# Altium project base_tiempo.PrjPcb
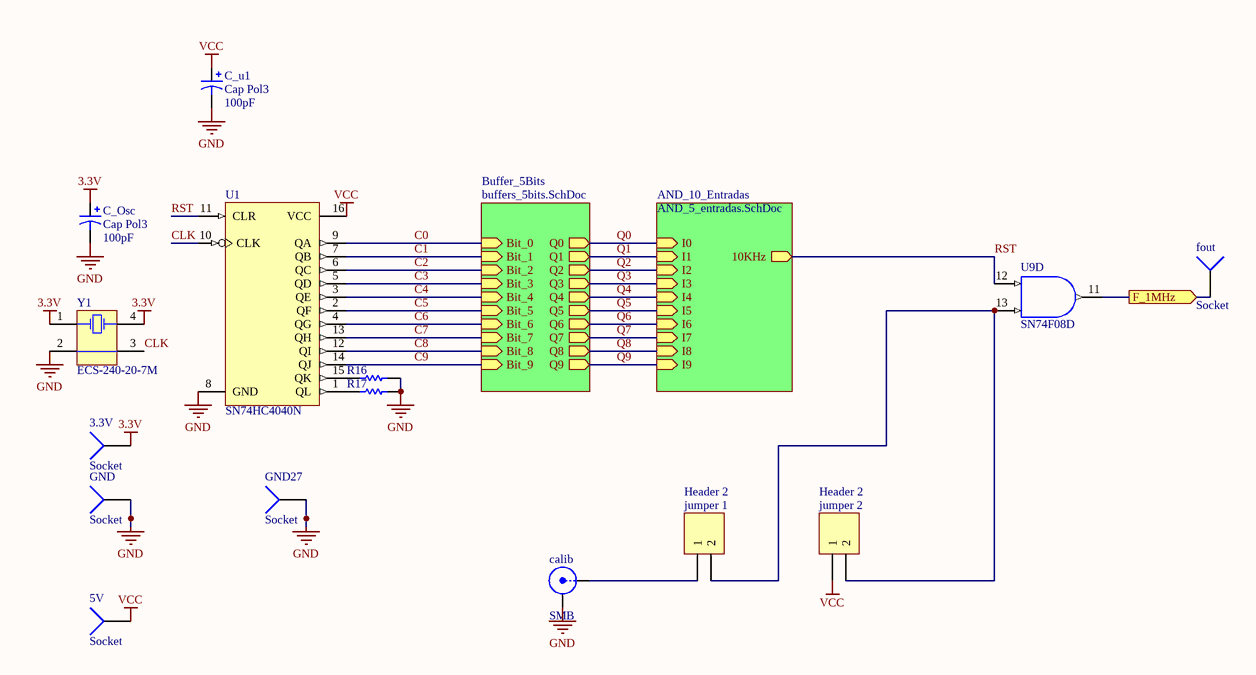
[diagram p0: base_tiempo.SchDoc]
3 sheets, 28 parts. Net scope: hierarchical (ports join the sheet entries above them; power ports are global).
Board file: base_tiempo.PcbDoc
Sheets:
  base_tiempo.SchDoc
    Buffer_5Bits = buffers_5bits.SchDoc
    AND_10_Entradas = AND_5_entradas.SchDoc

## Sheet base_tiempo.SchDoc: Base de tiempo
size A4; Revision: 1

### Parts
3.3V  Socket  [PIN1]
5V  Socket  [PIN1]
C_Osc  Cap Pol3  value 100pF  [C0805]
C_u1  Cap Pol3  value 100pF  [C0805]
calib  SMB  [SMB_V-RJ45]
fout  Socket  [PIN1]
GND  Socket  [PIN1]
GND27  Socket  [PIN1]
jumper_1  Header 2  [HDR1X2]
jumper_2  Header 2  [HDR1X2]
R16  Res Semi  [2012[0805]]  (value not drawn)
R17  Res Semi  [2012[0805]]  (value not drawn)
U1  SN74HC4040N  [N016]
U9  SN74F08D  [D014_N]  (part D of 4)
Y1  ECS-240-20-7M  [ECX-3M]

### Sub-sheets
AND_10_Entradas = AND_5_entradas.SchDoc: I0 (in), I1 (in), I2 (in), I3 (in), I4 (in), 10KHz (out), I5 (in), I6 (in), I7 (in), I8 (in), I9 (in)
Buffer_5Bits = buffers_5bits.SchDoc: Bit_0 (in), Bit_1 (in), Bit_2 (in), Bit_3 (in), Bit_4 (in), Q0 (out), Q1 (out), Q2 (out), Q3 (out), Q4 (out), Bit_5 (in), Bit_6 (in), Bit_7 (in), Bit_8 (in), Bit_9 (in), Q5 (out), Q6 (out), Q7 (out), Q8 (out), Q9 (out)

### Ports
F_1MHz (out)

### Nets
3.3V: 3.3V.1 C_Osc.1 Y1.1(OSC1) Y1.4(OSC2)
GND: C_Osc.2 C_u1.2 calib.2(Y) GND.1 GND27.1 R16.2 R17.2 U1.8(GND) U9.7(GND) Y1.2(COM)
VCC: 5V.1 C_u1.1 jumper_2.1 U1.16(VCC) U9.14(VCC)
C0: U1.9(QA) ; sheet Buffer_5Bits/Bit_0
C1: U1.7(QB) ; sheet Buffer_5Bits/Bit_1
C2: U1.6(QC) ; sheet Buffer_5Bits/Bit_2
C3: U1.5(QD) ; sheet Buffer_5Bits/Bit_3
C4: U1.3(QE) ; sheet Buffer_5Bits/Bit_4
C5: U1.2(QF) ; sheet Buffer_5Bits/Bit_5
C6: U1.4(QG) ; sheet Buffer_5Bits/Bit_6
C7: U1.13(QH) ; sheet Buffer_5Bits/Bit_7
C8: U1.12(QI) ; sheet Buffer_5Bits/Bit_8
C9: U1.14(QJ) ; sheet Buffer_5Bits/Bit_9
CLK: U1.10(CLK) Y1.3(COM)
Q0: sheet Buffer_5Bits/Q0, sheet AND_10_Entradas/I0
Q1: sheet Buffer_5Bits/Q1, sheet AND_10_Entradas/I1
Q2: sheet Buffer_5Bits/Q2, sheet AND_10_Entradas/I2
Q3: sheet Buffer_5Bits/Q3, sheet AND_10_Entradas/I3
Q4: sheet Buffer_5Bits/Q4, sheet AND_10_Entradas/I4
Q5: sheet Buffer_5Bits/Q5, sheet AND_10_Entradas/I5
Q6: sheet Buffer_5Bits/Q6, sheet AND_10_Entradas/I6
Q7: sheet Buffer_5Bits/Q7, sheet AND_10_Entradas/I7
Q8: sheet Buffer_5Bits/Q8, sheet AND_10_Entradas/I8
Q9: sheet Buffer_5Bits/Q9, sheet AND_10_Entradas/I9
RST: U1.11(CLR) U9.12(A) ; sheet AND_10_Entradas/10KHz  [project net 10KHz]
Netcalib_1: calib.1(X) jumper_1.1
Netfout_1: fout.1 U9.11(Y) ; port F_1MHz
Netjumper_1_2: jumper_1.2 jumper_2.2 U9.13(B)
NetR16_1: R16.1 U1.15(QK)
NetR17_1: R17.1 U1.1(QL)

### Library data of the parts
C_Osc C_u1 = Cap Pol3: Polarized Capacitor (Surface Mount); Published: 8-Jun-2000; LatestRevisionDate: 17-Jul-2002; LatestRevisionNote: Re-released for DXP Platform.; PackageReference: C0805; Publisher: Altium Limited
calib = SMB: SMB Straight Connector; LatestRevisionDate: 17-Jul-2002; LatestRevisionNote: Re-released for DXP Platform.; Publisher: Altium Limited
jumper_1 jumper_2 = Header 2: Header, 2-Pin; LatestRevisionDate: 17-Jul-2002; LatestRevisionNote: Re-released for DXP Platform.; Publisher: Altium Limited
R16 R17 = Res Semi: Semiconductor Resistor; Value: 1K; Published: 8-Jun-2000; LatestRevisionDate: 17-Jul-2002; LatestRevisionNote: Re-released for DXP Platform.; PackageReference: AXIAL-0.5; Publisher: Altium Limited
U1 = SN74HC4040N: 12-Bit Asynchronous Binary Counter; Published: 8-Jun-2000; LatestRevisionDate: 04-Mar-2005; LatestRevisionNote: Stylized 3D Model Added.; DatasheetVersion: May-1997; PackageVersion: Oct-1995; PackageReference: N016; Publisher: Altium Limited; PackageDescription: DIP; 16 Leads; Row Spacing 7.62 mm; Pitch 2.54 mm; Code_JEDEC: MS-001-BB; ComponentLink1Description: Manufacturer Link; ComponentLink1URL: http://www.ti.com/; ComponentLink2Description: Datasheet; ComponentLink2URL: http://www-s.ti.com/sc/ds/sn74hc4040.pdf
U9 = SN74F08D: Quadruple 2-Input Positive-AND Gate; Published: 8-Jun-2000; LatestRevisionDate: 13-Apr-2006; LatestRevisionNote: IPC-7351 Footprint Added.; DatasheetVersion: Oct-1993; PackageVersion: Jan-1998; PackageReference: D014; Publisher: Altium Limited; PackageDescription: 14-Pin Small Outline Integrated Circuit 1.27 mm Pitch; Code_IPC: SOIC127P600-14; ComponentLink1Description: Manufacturer Link; ComponentLink1URL: http://www.ti.com/; ComponentLink2Description: Datasheet; ComponentLink2URL: http://www-s.ti.com/sc/ds/SN74F08.pdf
Y1 = ECS-240-20-7M: Crystal Oscillator; Published: 17-Jul-2002; DatasheetDocument: 18-Apr-2000; PackageReference: ECX-3M; Publisher: Altium Limited; ComponentLink1Description: Manufacturer Link; ComponentLink1URL: http://www.ecsxtal.com/
3.3V 5V fout GND GND27 = Socket: LatestRevisionDate: 17-Jul-2002; LatestRevisionNote: Re-released for DXP Platform.; Publisher: Altium Limited

## Sheet buffers_5bits.SchDoc
size A4
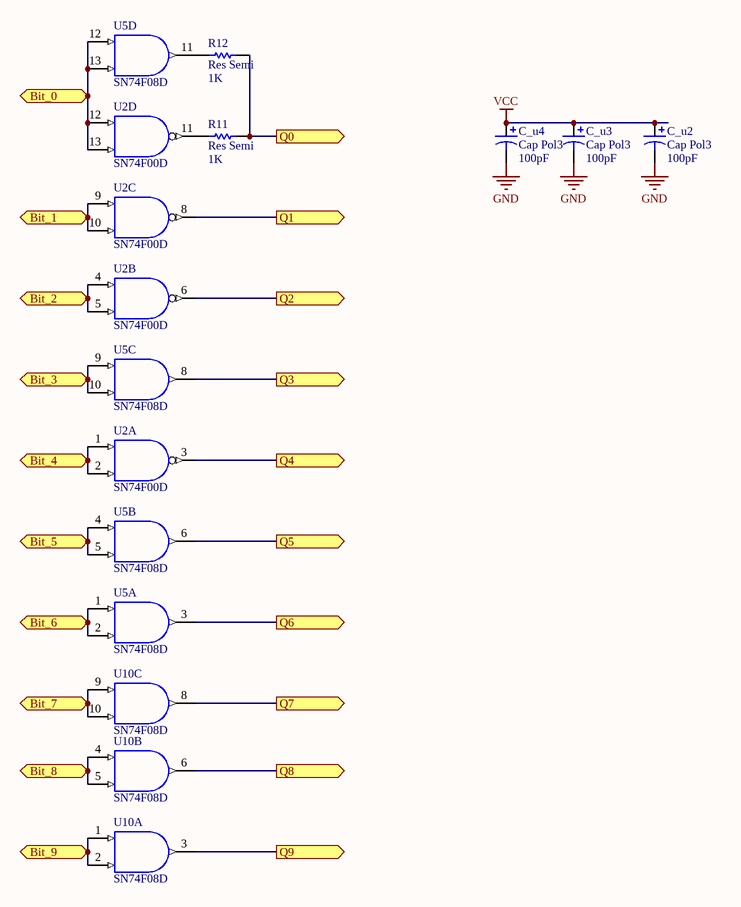
[diagram p1: buffers_5bits.SchDoc]

### Parts
C_u2  Cap Pol3  value 100pF  [C0805]
C_u3  Cap Pol3  value 100pF  [C0805]
C_u4  Cap Pol3  value 100pF  [C0805]
R11  Res Semi  value 1K  [2012[0805]]
R12  Res Semi  value 1K  [2012[0805]]
U2  SN74F00D  [D014_N]  (parts A,B,C,D of 4)
U5  SN74F08D  [D014_N]  (parts A,B,C,D of 4)
U10  SN74F08D  [D014_N]  (parts A,B,C of 4)

### Ports
Bit_0 (in), Bit_1 (in), Bit_2 (in), Bit_3 (in), Bit_4 (in), Bit_5 (in), Bit_6 (in), Bit_7 (in), Bit_8 (in), Bit_9 (in), Q0 (out), Q1 (out), Q2 (out), Q3 (out), Q4 (out), Q5 (out), Q6 (out), Q7 (out), Q8 (out), Q9 (out)

### Nets
GND: C_u2.2 C_u3.2 C_u4.2 U2.7(GND) U5.7(GND) U10.7(GND)
VCC: C_u2.1 C_u3.1 C_u4.1 U2.14(VCC) U5.14(VCC) U10.14(VCC)
C0: U2.12(A) U2.13(B) U5.12(A) U5.13(B) ; port Bit_0
C1: U2.9(A) U2.10(B) ; port Bit_1
C2: U2.4(A) U2.5(B) ; port Bit_2
C3: U5.9(A) U5.10(B) ; port Bit_3
C4: U2.1(A) U2.2(B) ; port Bit_4
C5: U5.4(A) U5.5(B) ; port Bit_5
C6: U5.1(A) U5.2(B) ; port Bit_6
C7: U10.9(A) U10.10(B) ; port Bit_7
C8: U10.4(A) U10.5(B) ; port Bit_8
C9: U10.1(A) U10.2(B) ; port Bit_9
Q0: R11.1 R12.1 ; port Q0
Q1: U2.8(Y) ; port Q1
Q2: U2.6(Y) ; port Q2
Q3: U5.8(Y) ; port Q3
Q4: U2.3(Y) ; port Q4
Q5: U5.6(Y) ; port Q5
Q6: U5.3(Y) ; port Q6
Q7: U10.8(Y) ; port Q7
Q8: U10.6(Y) ; port Q8
Q9: U10.3(Y) ; port Q9
NetR11_2: R11.2 U2.11(Y)
NetR12_2: R12.2 U5.11(Y)

### Library data of the parts
C_u2-C_u4 = Cap Pol3: Polarized Capacitor (Surface Mount); Published: 8-Jun-2000; LatestRevisionDate: 17-Jul-2002; LatestRevisionNote: Re-released for DXP Platform.; PackageReference: C0805; Publisher: Altium Limited
R11 R12 = Res Semi: Semiconductor Resistor; Published: 8-Jun-2000; LatestRevisionDate: 17-Jul-2002; LatestRevisionNote: Re-released for DXP Platform.; PackageReference: AXIAL-0.5; Publisher: Altium Limited
U2 = SN74F00D: Quadruple 2-Input Positive-NAND Gate; Published: 8-Jun-2000; LatestRevisionDate: 13-Apr-2006; LatestRevisionNote: IPC-7351 Footprint Added.; DatasheetVersion: Oct-1993; PackageVersion: Jan-1998; PackageReference: D014; Publisher: Altium Limited; PackageDescription: 14-Pin Small Outline Integrated Circuit 1.27 mm Pitch; Code_IPC: SOIC127P600-14; ComponentLink1Description: Manufacturer Link; ComponentLink1URL: http://www.ti.com/; ComponentLink2Description: Datasheet; ComponentLink2URL: http://www-s.ti.com/sc/ds/SN54F00.pdf
U5 U10 = SN74F08D: Quadruple 2-Input Positive-AND Gate; Published: 8-Jun-2000; LatestRevisionDate: 13-Apr-2006; LatestRevisionNote: IPC-7351 Footprint Added.; DatasheetVersion: Oct-1993; PackageVersion: Jan-1998; PackageReference: D014; Publisher: Altium Limited; PackageDescription: 14-Pin Small Outline Integrated Circuit 1.27 mm Pitch; Code_IPC: SOIC127P600-14; ComponentLink1Description: Manufacturer Link; ComponentLink1URL: http://www.ti.com/; ComponentLink2Description: Datasheet; ComponentLink2URL: http://www-s.ti.com/sc/ds/SN74F08.pdf

## Sheet AND_5_entradas.SchDoc
size A4; PageSetup: Record=PageOptions|CenterHorizontal=True|CenterVertical=True|PrintScale=0.97|XCorrection=1.00|YCorrection=1.00|PrintKind=2|BorderSize=5000000|LeftOffset=0|BottomOffset=0|Orientation=2|PaperLength=1000|PaperWidth=1000|Scale=100|PaperSource=7|PrintQuality=-4|MediaType=1|DitherType=10|PaperKind=A4|PrintScaleMode=1
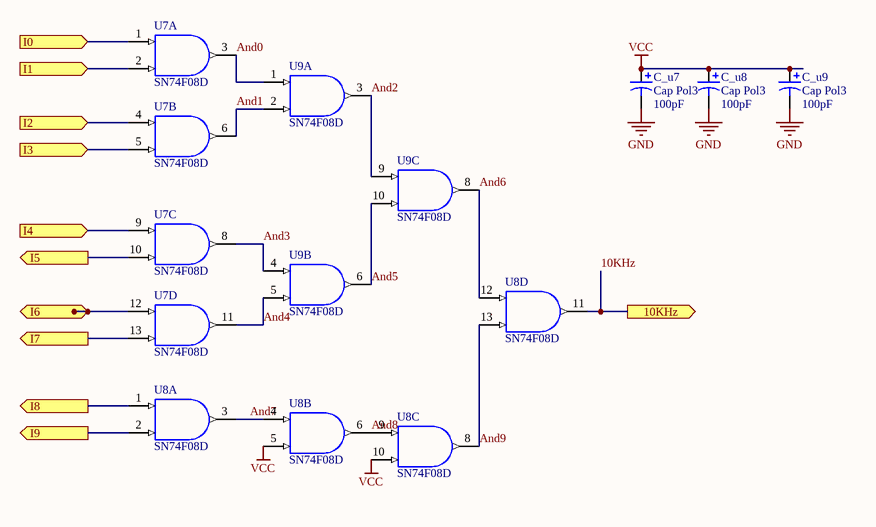
[diagram p2: AND_5_entradas.SchDoc]

### Parts
C_u7  Cap Pol3  value 100pF  [C0805]
C_u8  Cap Pol3  value 100pF  [C0805]
C_u9  Cap Pol3  value 100pF  [C0805]
U7  SN74F08D  [D014_N]  (parts A,B,C,D of 4)
U8  SN74F08D  [D014_N]  (parts A,B,C,D of 4)
U9  SN74F08D  [D014_N]  (parts A,B,C of 4)

### Ports
10KHz (out), I0 (in), I1 (in), I2 (in), I3 (in), I4 (in), I5 (out), I6 (out), I7 (out), I8 (out), I9 (out)

### Nets
GND: C_u7.2 C_u8.2 C_u9.2 U7.7(GND) U8.7(GND) U9.7(GND)
VCC: C_u7.1 C_u8.1 C_u9.1 U7.14(VCC) U8.5(B) U8.10(B) U8.14(VCC) U9.14(VCC)
10KHz: U8.11(Y) ; port 10KHz
And0: U7.3(Y) U9.1(A)
And1: U7.6(Y) U9.2(B)
And2: U9.3(Y) U9.9(A)
And3: U7.8(Y) U9.4(A)
And4: U7.11(Y) U9.5(B)
And5: U9.6(Y) U9.10(B)
And6: U8.12(A) U9.8(Y)
And7: U8.3(Y) U8.4(A)
And8: U8.6(Y) U8.9(A)
And9: U8.8(Y) U8.13(B)
Q0: U7.1(A) ; port I0
Q1: U7.2(B) ; port I1
Q2: U7.4(A) ; port I2
Q3: U7.5(B) ; port I3
Q4: U7.9(A) ; port I4
Q5: U7.10(B) ; port I5
Q6: U7.12(A) ; port I6
Q7: U7.13(B) ; port I7
Q8: U8.1(A) ; port I8
Q9: U8.2(B) ; port I9

### Library data of the parts
C_u7-C_u9 = Cap Pol3: Polarized Capacitor (Surface Mount); Published: 8-Jun-2000; LatestRevisionDate: 17-Jul-2002; LatestRevisionNote: Re-released for DXP Platform.; PackageReference: C0805; Publisher: Altium Limited
U7-U9 = SN74F08D: Quadruple 2-Input Positive-AND Gate; Published: 8-Jun-2000; LatestRevisionDate: 13-Apr-2006; LatestRevisionNote: IPC-7351 Footprint Added.; DatasheetVersion: Oct-1993; PackageVersion: Jan-1998; PackageReference: D014; Publisher: Altium Limited; PackageDescription: 14-Pin Small Outline Integrated Circuit 1.27 mm Pitch; Code_IPC: SOIC127P600-14; ComponentLink1Description: Manufacturer Link; ComponentLink1URL: http://www.ti.com/; ComponentLink2Description: Datasheet; ComponentLink2URL: http://www-s.ti.com/sc/ds/SN74F08.pdf

## Nets that join several sheets
GND: base_tiempo (10 pins), buffers_5bits (6 pins), AND_5_entradas (6 pins)
VCC: base_tiempo (5 pins), buffers_5bits (6 pins), AND_5_entradas (8 pins)
10KHz: base_tiempo (U1.11 U9.12), AND_5_entradas (U8.11)
C0: base_tiempo (U1.9), buffers_5bits (U2.12 U2.13 U5.12 U5.13)
C1: base_tiempo (U1.7), buffers_5bits (U2.9 U2.10)
C2: base_tiempo (U1.6), buffers_5bits (U2.4 U2.5)
C3: base_tiempo (U1.5), buffers_5bits (U5.9 U5.10)
C4: base_tiempo (U1.3), buffers_5bits (U2.1 U2.2)
C5: base_tiempo (U1.2), buffers_5bits (U5.4 U5.5)
C6: base_tiempo (U1.4), buffers_5bits (U5.1 U5.2)
C7: base_tiempo (U1.13), buffers_5bits (U10.9 U10.10)
C8: base_tiempo (U1.12), buffers_5bits (U10.4 U10.5)
C9: base_tiempo (U1.14), buffers_5bits (U10.1 U10.2)
Q0: buffers_5bits (R11.1 R12.1), AND_5_entradas (U7.1)
Q1: buffers_5bits (U2.8), AND_5_entradas (U7.2)
Q2: buffers_5bits (U2.6), AND_5_entradas (U7.4)
Q3: buffers_5bits (U5.8), AND_5_entradas (U7.5)
Q4: buffers_5bits (U2.3), AND_5_entradas (U7.9)
Q5: buffers_5bits (U5.6), AND_5_entradas (U7.10)
Q6: buffers_5bits (U5.3), AND_5_entradas (U7.12)
Q7: buffers_5bits (U10.8), AND_5_entradas (U7.13)
Q8: buffers_5bits (U10.6), AND_5_entradas (U8.1)
Q9: buffers_5bits (U10.3), AND_5_entradas (U8.2)